# EAGLE design QuadEnc50 (EAGLE 5.10)
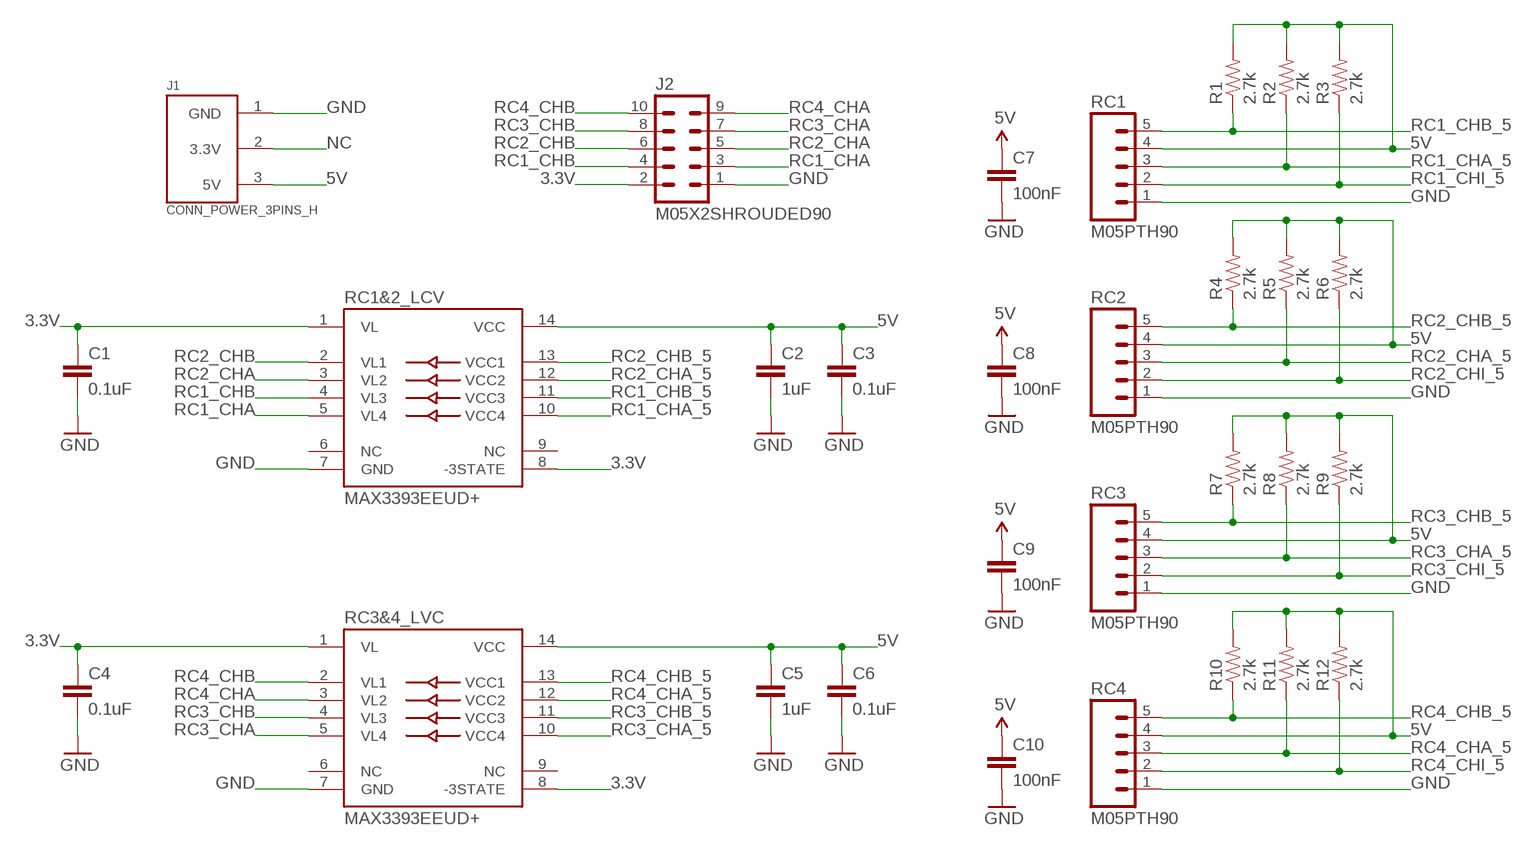
[diagram p0: schematic, sheet 1]

## Parts
C1  0.1uF  CAP0805  [0805]
C2  1uF  CAP0805  [0805]
C3  0.1uF  CAP0805  [0805]
C4  0.1uF  CAP0805  [0805]
C5  1uF  CAP0805  [0805]
C6  0.1uF  CAP0805  [0805]
C7  100nF  CAP0805  [0805]
C8  100nF  CAP0805  [0805]
C9  100nF  CAP0805  [0805]
C10  100nF  CAP0805  [0805]
J1  CONN_POWER_3PINS_H  [3PINS_3.81MM_90DEG]
J2  M05X2SHROUDED90  [2X05/90/SHROUDED]
R1  2.7k  RESISTOR0805  [0805]
R2  2.7k  RESISTOR0805  [0805]
R3  2.7k  RESISTOR0805  [0805]
R4  2.7k  RESISTOR0805  [0805]
R5  2.7k  RESISTOR0805  [0805]
R6  2.7k  RESISTOR0805  [0805]
R7  2.7k  RESISTOR0805  [0805]
R8  2.7k  RESISTOR0805  [0805]
R9  2.7k  RESISTOR0805  [0805]
R10  2.7k  RESISTOR0805  [0805]
R11  2.7k  RESISTOR0805  [0805]
R12  2.7k  RESISTOR0805  [0805]
RC1  M05PTH90  [1X05/90]
RC1&2_LCV  MAX3393EEUD+  [TSSOP-14]
RC2  M05PTH90  [1X05/90]
RC3  M05PTH90  [1X05/90]
RC3&4_LVC  MAX3393EEUD+  [TSSOP-14]
RC4  M05PTH90  [1X05/90]

## Nets
3.3V: C1.1 C4.1 J2.2 RC1&2_LCV.1(VL) RC1&2_LCV.8(-3STATE) RC3&4_LVC.1(VL) RC3&4_LVC.8(-3STATE)
5V: C2.1 C3.1 C5.1 C6.1 C7.1 C8.1 C9.1 C10.1 J1.3(5V) R1.2 R2.2 R3.2 R4.2 R5.2 R6.2 R7.2 R8.2 R9.2 R10.2 R11.2 R12.2 RC1&2_LCV.14(VCC) RC1.4 RC2.4 RC3&4_LVC.14(VCC) RC3.4 RC4.4
GND: C1.2 C2.2 C3.2 C4.2 C5.2 C6.2 C7.2 C8.2 C9.2 C10.2 J1.1(GND) J2.1 RC1&2_LCV.7(GND) RC1.1 RC2.1 RC3&4_LVC.7(GND) RC3.1 RC4.1
NC: J1.2(3.3V)
RC1_CHA: J2.3 RC1&2_LCV.5(VL4)
RC1_CHA_5: R2.1 RC1&2_LCV.10(VCC4) RC1.3
RC1_CHB: J2.4 RC1&2_LCV.4(VL3)
RC1_CHB_5: R1.1 RC1&2_LCV.11(VCC3) RC1.5
RC1_CHI_5: R3.1 RC1.2
RC2_CHA: J2.5 RC1&2_LCV.3(VL2)
RC2_CHA_5: R5.1 RC1&2_LCV.12(VCC2) RC2.3
RC2_CHB: J2.6 RC1&2_LCV.2(VL1)
RC2_CHB_5: R4.1 RC1&2_LCV.13(VCC1) RC2.5
RC2_CHI_5: R6.1 RC2.2
RC3_CHA: J2.7 RC3&4_LVC.5(VL4)
RC3_CHA_5: R8.1 RC3&4_LVC.10(VCC4) RC3.3
RC3_CHB: J2.8 RC3&4_LVC.4(VL3)
RC3_CHB_5: R7.1 RC3&4_LVC.11(VCC3) RC3.5
RC3_CHI_5: R9.1 RC3.2
RC4_CHA: J2.9 RC3&4_LVC.3(VL2)
RC4_CHA_5: R11.1 RC3&4_LVC.12(VCC2) RC4.3
RC4_CHB: J2.10 RC3&4_LVC.2(VL1)
RC4_CHB_5: R10.1 RC3&4_LVC.13(VCC1) RC4.5
RC4_CHI_5: R12.1 RC4.2
Unconnected: RC1&2_LCV.6(NC) RC1&2_LCV.9(NC) RC3&4_LVC.6(NC) RC3&4_LVC.9(NC)

## Library data of the parts
C1-C10 = Robot:CAP: CAPACITOR
J1 = Robot:CONN_POWER_3PINS: POWER CONNECTOR for logic boards. Provides 3.3V and 5V.
J2 = Robot:M05X2: 10-PIN DUAL ROW HEADER Standard 10-pin dual row 0.1" header.
R1-R12 = Robot:RESISTOR: RESISTOR
RC1-RC4 = Robot:M05: 5-PIN HEADER Standard 5-pin 0.1" header.
RC1&2_LCV RC3&4_LVC = Robot:MAX3393E: Low-Voltage Level Translator Page du fabricant: http://www.maxim-ic.com/quick_view2.cfm/qv_pk/3253 Datasheet: http://datasheets.maxim-ic.com/en/ds/MAX3372E-MAX3393E.pdf

## Board
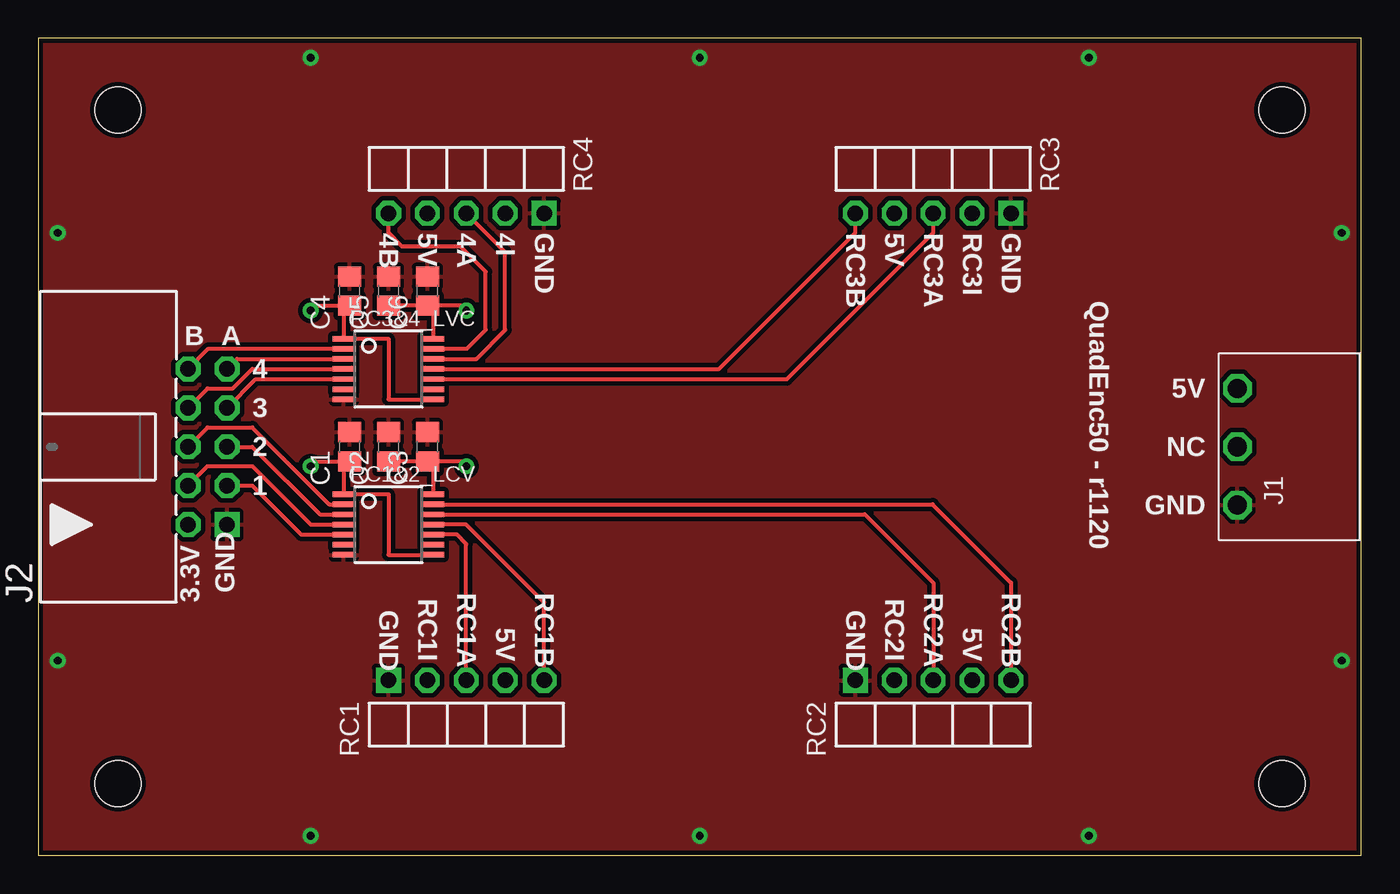
[diagram p1: board, top side]
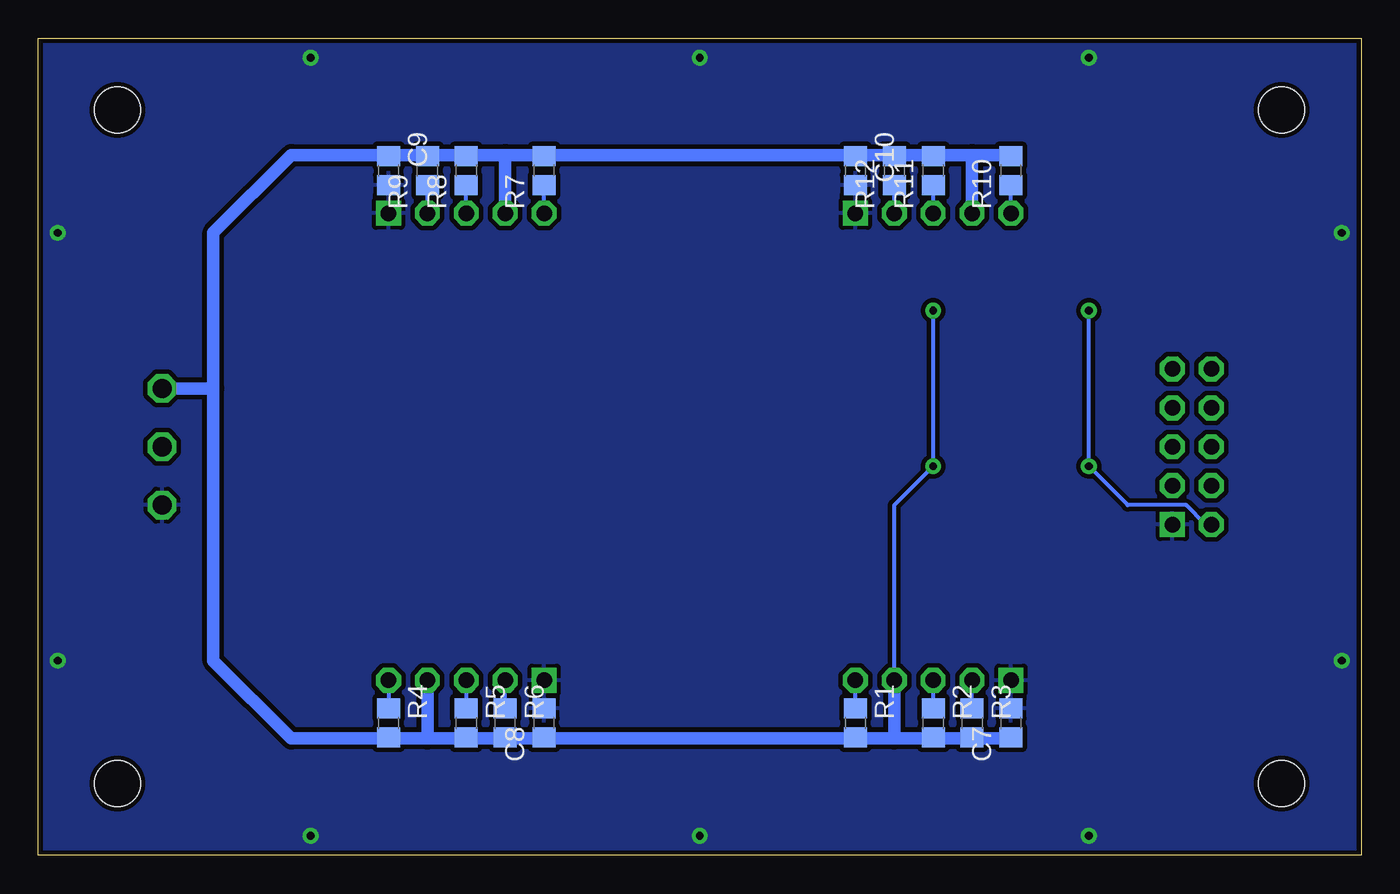
[diagram p2: board, bottom side, seen from below]

Size 86.36 x 53.34 mm. Coordinates in mm from the lower left corner, seen from the top.
Outline: 0,0 86.36,0 86.36,53.34 0,53.34 0,0
Copper layers (1*16): Top 0.035mm / dielectric 1.5mm / Bottom 0.035mm
Design rules "SparkFun": minimum track width 8mil, minimum drill 20mil, track to track 8mil, track to pad 8mil, pad to pad 8mil, via to via 8mil, smd to smd 8mil, copper to edge 10mil, drill to drill 8mil, minimum pad ring 12mil, minimum via ring 10mil, stop-mask expansion 4mil, vias tented up to drill 25mil, thermal gap 10mil
Holes 3 mm at 5.2,4.67 81.2,4.67 5.2,48.67 81.2,48.67

### Footprints (pad centres in the part's own frame; a part is rotated, then mirrored left to right if it is on the bottom)
0805 = smd 1.3 x 1.5: 1 -0.95,0; 2 0.95,0
3PINS_3.81MM_90DEG = drill 1.25 octagon: 1 -3.81,3; 2 0,3; 3 3.81,3
2X05/90/SHROUDED = drill 1.016 square: 1 -5.08,-1.27 | drill 1.016 octagon: 2 -5.08,1.27; 3 -2.54,-1.27; 4 -2.54,1.27; 5 0,-1.27; 6 0,1.27; 7 2.54,-1.27; 8 2.54,1.27; 9 5.08,-1.27; 10 5.08,1.27
1X05/90 = drill 1.016 square: 1 0,-0.01 | drill 1.016 octagon: 2 2.54,-0.01; 3 5.08,-0.01; 4 7.62,-0.01; 5 10.16,-0.01
TSSOP-14 = smd 1.422 x 0.356: 1 -2.921,1.981; 2 -2.921,1.321; 3 -2.921,0.66; 4 -2.921,0; 5 -2.921,-0.66; 6 -2.921,-1.321; 7 -2.921,-1.981; 8 2.921,-1.981; 9 2.921,-1.321; 10 2.921,-0.66; 11 2.921,0; 12 2.921,0.66; 13 2.921,1.321; 14 2.921,1.981

### Placement (x,y rotation side)
C1  20.32,26.67 90 top
C2  22.86,26.67 90 top
C3  25.4,26.67 90 top
C4  20.32,36.83 90 top
C5  22.86,36.83 90 top
C6  25.4,36.83 90 top
C7  22.86,8.64 90 bottom
C8  53.34,8.64 90 bottom
C9  63.5,44.7 270 bottom
C10  33.02,44.7 270 bottom
J1  81.28,26.67 90 top
J2  11.05,26.67 90 top
R1  33.02,8.64 270 bottom
R2  27.94,8.64 270 bottom
R3  25.4,8.64 270 bottom
R4  63.5,8.64 270 bottom
R5  58.42,8.64 270 bottom
R6  55.88,8.64 270 bottom
R7  53.34,44.7 90 bottom
R8  58.42,44.7 90 bottom
R9  60.96,44.7 90 bottom
R10  22.86,44.7 90 bottom
R11  27.94,44.7 90 bottom
R12  30.48,44.7 90 bottom
RC1  22.86,11.43 0 top
RC1&2_LCV  22.86,21.59 0 top
RC2  53.34,11.43 0 top
RC3  63.5,41.91 180 top
RC3&4_LVC  22.86,31.75 0 top
RC4  33.02,41.91 180 top

### Tracks (layer width: path | path; a pad name or v marks a point on that pad's centre or on a via)
3.3V  (via drill 0.51)
  Top 0.254: RC1&2_LCV.8 22.86,19.61 22.86,23.57 RC1&2_LCV.1 19.94,25.34 C1.1 18.1,25.72 v17.78,25.4 | RC3&4_LVC.8 22.86,29.77 22.86,33.73 RC3&4_LVC.1 19.94,35.5 C4.1 18.1,35.88 v17.78,35.56
  Bottom 0.254: J2.2 10.16,21.59 11.43,22.86 15.24,22.86 v17.78,25.4 v17.78,35.56
5V  (via drill 0.51)
  Top 0.254: C6.1 27.62,35.88 v27.94,35.56 | C3.1 27.62,25.72 v27.94,25.4 | C3.1 C2.1 | C6.1 C5.1 | RC3&4_LVC.14 25.78,35.5 C6.1 | RC1&2_LCV.14 25.78,25.34 C3.1
  Bottom 0.254: v27.94,35.56 v27.94,25.4 30.48,22.86 RC1.4
  Bottom 0.813: 74.93,30.48 J1.3 | 63.5,45.72 60.96,45.72 | 60.96,45.72 58.42,45.72 | 58.42,45.72 55.88,45.72 | 55.88,45.72 53.34,45.72 | 53.34,45.72 33.02,45.72 | 63.5,45.72 69.85,45.72 74.93,40.64 74.93,30.48 | 33.02,45.72 C10.1 | 63.5,45.72 C9.1 | 33.02,45.72 30.48,45.72 | 30.48,45.72 27.94,45.72 | 27.94,45.72 25.4,45.72 | C7.1 22.86,7.62 25.4,7.62 | 25.4,7.62 27.94,7.62 | 27.94,7.62 30.48,7.62 | 30.48,7.62 33.02,7.62 | 33.02,7.62 53.34,7.62 | 53.34,7.62 C8.1 | 53.34,7.62 55.88,7.62 | 55.88,7.62 58.42,7.62 | 58.42,7.62 60.96,7.62 | 60.96,7.62 63.5,7.62 | 63.5,7.62 69.85,7.62 74.93,12.7 74.93,30.48 | 25.4,45.72 RC4.4 | 55.88,45.72 RC3.4 | 60.96,7.62 RC2.4 | 30.48,7.62 RC1.4 | 25.4,45.72 22.93,45.72 R10.2 | 27.94,45.72 R11.2 | 30.48,45.72 R12.2 | 53.34,45.72 R7.2 | 58.42,45.72 R8.2 | 60.96,45.72 R9.2 | 63.5,7.62 R4.2 | 55.88,7.62 R6.2 | 58.42,7.62 R5.2 | 33.02,7.62 R1.2 | 25.4,7.62 R3.2 | 27.94,7.62 R2.2
GND  (via drill 0.51)
  other vias: 1.27,12.7 1.27,40.64 68.58,1.27 43.18,1.27 17.78,1.27 85.09,12.7 85.09,40.64 17.78,52.07 43.18,52.07 68.58,52.07
  pour Top (isolate 0.305): 0,0 0,53.34 86.36,53.34 86.36,0
  pour Bottom (isolate 0.305): 0,0 0,53.34 86.36,53.34 86.36,0
RC1_CHA
  Top 0.254: RC1&2_LCV.5 17.17,20.93 13.97,24.13 J2.3
RC1_CHA_5
  Top 0.254: RC1&2_LCV.10 27.33,20.93 27.94,20.32 RC1.3
  Bottom 0.254: R2.1 RC1.3
RC1_CHB
  Top 0.254: RC1&2_LCV.4 17.78,21.59 13.97,25.4 11.05,25.4 J2.4
RC1_CHB_5
  Top 0.254: RC1&2_LCV.11 27.94,21.59 33.02,16.51 RC1.5
  Bottom 0.254: R1.1 RC1.5
RC1_CHI_5
  Bottom 0.254: R3.1 RC1.2
RC2_CHA
  Top 0.254: RC1&2_LCV.3 18.39,22.25 13.97,26.67 J2.5
RC2_CHA_5
  Top 0.254: RC1&2_LCV.12 53.95,22.25 58.42,17.78 RC2.3
  Bottom 0.254: RC2.3 R5.1
RC2_CHB
  Top 0.254: RC1&2_LCV.2 19,22.91 13.97,27.94 11.05,27.94 J2.6
RC2_CHB_5
  Top 0.254: RC1&2_LCV.13 58.37,22.91 63.5,17.78 RC2.5
  Bottom 0.254: RC2.5 R4.1
RC2_CHI_5
  Bottom 0.254: R6.1 RC2.2
RC3_CHA
  Top 0.254: RC3&4_LVC.5 14.2,31.09 J2.7
RC3_CHA_5
  Top 0.254: RC3&4_LVC.10 48.87,31.09 58.42,40.64 RC3.3
  Bottom 0.254: RC3.3 R8.1
RC3_CHB
  Top 0.254: RC3&4_LVC.4 13.97,31.75 12.7,30.48 11.05,30.48 J2.8
RC3_CHB_5
  Top 0.254: RC3&4_LVC.11 44.45,31.75 53.34,40.64 RC3.5
  Bottom 0.254: RC3.5 R7.1
RC3_CHI_5
  Bottom 0.254: RC3.2 R9.1
RC4_CHA
  Top 0.254: RC3&4_LVC.3 12.98,32.41 J2.9
RC4_CHA_5
  Top 0.254: RC3&4_LVC.12 28.6,32.41 30.48,34.29 30.48,39.38 RC4.3
  Bottom 0.254: RC4.3 R11.1
RC4_CHB
  Top 0.254: RC3&4_LVC.2 11.1,33.07 J2.10
RC4_CHB_5
  Top 0.254: RC3&4_LVC.13 27.99,33.07 29.21,34.29 29.21,38.1 27.56,39.75 23.75,39.75 22.86,40.64 RC4.5
  Bottom 0.254: RC4.5 R10.1
RC4_CHI_5
  Bottom 0.254: RC4.2 R12.1

### Text on the board
tPlace: 4B | 5V | 4A | 4I | GND | RC3B | 5V | RC3A | RC3I | GND | QuadEnc50 - r1120 | B | A | 4 | 5V | 3 | NC | 2 | 1 | GND | 3.3V | GND | RC1I | RC1A | RC1B | RC2I | RC2A | RC2B | GND | GND | 5V | 5V